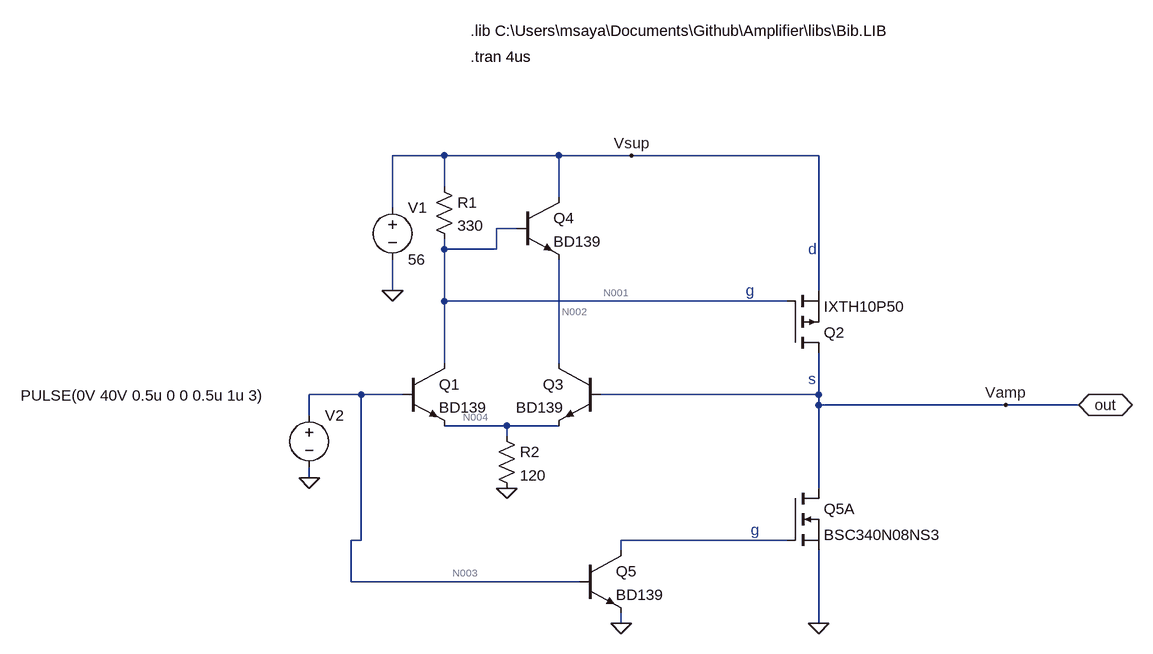
[diagram p0: schematic Push pull.asc]
Push pull.asc, the LTspice schematic file:
Version 4
SHEET 1 7116 2452
WIRE 416 -272 336 -272
WIRE 592 -272 416 -272
WIRE 704 -272 592 -272
WIRE 992 -272 704 -272
WIRE 416 -224 416 -272
WIRE 592 -208 592 -272
WIRE 336 -192 336 -272
WIRE 528 -160 496 -160
WIRE 416 -128 416 -144
WIRE 496 -128 496 -160
WIRE 496 -128 416 -128
WIRE 336 -64 336 -112
WIRE 992 -64 992 -272
WIRE 416 -48 416 -128
WIRE 944 -48 416 -48
WIRE 416 48 416 -48
WIRE 592 48 592 -112
WIRE 288 96 208 96
WIRE 352 96 288 96
WIRE 992 96 992 32
WIRE 992 96 656 96
WIRE 992 112 992 96
WIRE 1280 112 992 112
WIRE 1392 112 1280 112
WIRE 208 128 208 96
WIRE 512 144 416 144
WIRE 592 144 512 144
WIRE 512 160 512 144
WIRE 208 224 208 208
WIRE 992 240 992 112
WIRE 288 320 288 96
WIRE 288 320 272 320
WIRE 944 320 688 320
WIRE 688 336 688 320
WIRE 272 384 272 320
WIRE 624 384 272 384
WIRE 688 448 688 432
WIRE 992 448 992 336
FLAG 336 -64 0
FLAG 704 -272 Vsup
FLAG 208 224 0
FLAG 1392 112 out
IOPIN 1392 112 BiDir
FLAG 1280 112 Vamp
FLAG 992 448 0
FLAG 512 240 0
FLAG 688 448 0
SYMBOL voltage 336 -208 R0
WINDOW 123 0 0 Left 0
WINDOW 39 0 0 Left 0
SYMATTR InstName V1
SYMATTR Value 56
SYMBOL pmos 944 32 M180
SYMATTR InstName Q2
SYMATTR Value IXTH10P50
SYMBOL nmos 944 240 R0
SYMATTR InstName Q5A
SYMATTR Value BSC340N08NS3
SYMBOL voltage 208 112 R0
WINDOW 123 0 0 Left 0
WINDOW 39 0 0 Left 0
WINDOW 3 -444 -15 Left 2
SYMATTR Value PULSE(0V 40V 0.5u 0 0 0.5u 1u 3)
SYMATTR InstName V2
SYMBOL npn 352 48 R0
SYMATTR InstName Q1
SYMATTR Value BD139
SYMBOL npn 656 48 M0
SYMATTR InstName Q3
SYMATTR Value BD139
SYMBOL res 400 -240 R0
SYMATTR InstName R1
SYMATTR Value 330
SYMBOL res 496 144 R0
SYMATTR InstName R2
SYMATTR Value 120
SYMBOL npn 528 -208 R0
SYMATTR InstName Q4
SYMATTR Value BD139
SYMBOL npn 624 336 R0
SYMATTR InstName Q5
SYMATTR Value BD139
TEXT 456 -424 Left 2 !.tran 4us
TEXT 456 -464 Left 2 !.lib C:\\Users\\msaya\\Documents\\Github\\Amplifier\\libs\\Bib.LIB
TEXT 880 -64 Left 2 ;g
TEXT 888 304 Left 2 ;g
TEXT 976 72 Left 2 ;s
TEXT 976 -128 Left 2 ;d

The netlist it stands for:
* Push pull.asc
V1 Vsup 0 56
M§Q2 Vamp N001 Vsup Vsup IXTH10P50
M§Q5A Vamp N005 0 0 BSC340N08NS3
V2 N003 0 PULSE(0V 40V 0.5u 0 0 0.5u 1u 3)
Q1 N001 N003 N004 0 BD139
Q3 N002 Vamp N004 0 BD139
R1 Vsup N001 330
R2 N004 0 120
Q4 Vsup N001 N002 0 BD139
Q5 N005 N003 0 0 BD139
.model NPN NPN
.model PNP PNP
.lib standard.bjt
.model NMOS NMOS
.model PMOS PMOS
.lib standard.mos
.tran 4us
.lib C:\Users\msaya\Documents\Github\Amplifier\libs\Bib.LIB
* g
* g
* s
* d
.backanno
.end

* Results of the author's LTspice run, read from the files saved beside the schematic
* Operating Point, zero values left out:
*   V(vsup) = 56 V
*   V(vamp) = 774.1 mV
*   V(n001) = 55.98 V
*   V(n004) = 460.2 mV
*   V(n002) = 55.65 V
*   Ic(Q1) = 5.82 nA
*   Ib(Q1) = -10.86 nA
*   Ie(Q1) = 5.039 nA
*   Ic(Q3) = 3.807 mA
*   Ib(Q3) = 27.78 µA
*   Ie(Q3) = -3.835 mA
*   Ic(Q4) = 3.754 mA
*   Ib(Q4) = 53.06 µA
*   Ie(Q4) = -3.807 mA
*   Id(Q2) = -27.78 µA
*   Ib(Q2) = -7.105 µA
*   Is(Q2) = 27.61 µA
*   Id(Q5a) = 9.767 pA
*   Is(Q5a) = -9.767 pA
*   I(R1) = 53.07 µA
*   I(R2) = 3.835 mA
*   I(V1) = -3.823 mA
*   I(V2) = 10.86 nA
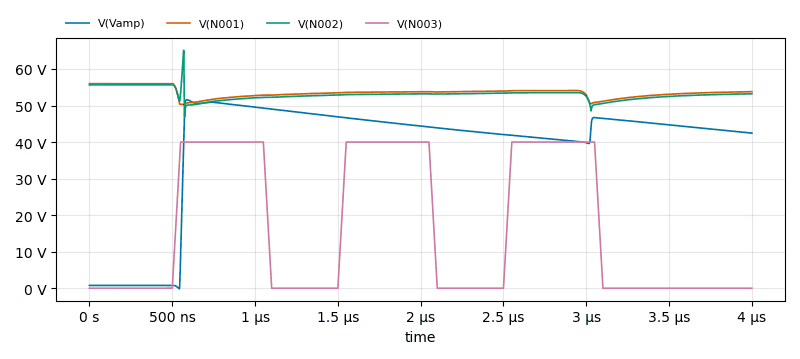
[diagram p1: Transient Analysis of Push pull.asc, plotted from the saved traces]
* Transient Analysis, 1 run:
*   V(Vamp): min -155.3 mV, max 51.58 V, average 39.03 V, rms 42.03 V, last 42.45 V
*   V(N001): min 50.24 V, max 55.99 V, average 53.51 V, rms 53.53 V, last 53.79 V
*   V(N002): min 47.01 V, max 65.09 V, average 53.02 V, rms 53.03 V, last 53.21 V
*   V(N003): min 0 V, max 40 V, average 16.5 V, rms 25.3 V, last 0 V